# EasyEDA schematic SCH_Altimeter-Attiny_2021-11-18.json
TITLE: TinyAltimeter; REV: 1.0; Date: 2021-11-16; Sheet: 1/1; Drawn By: Sujay Sreedhar; Company: SSERD
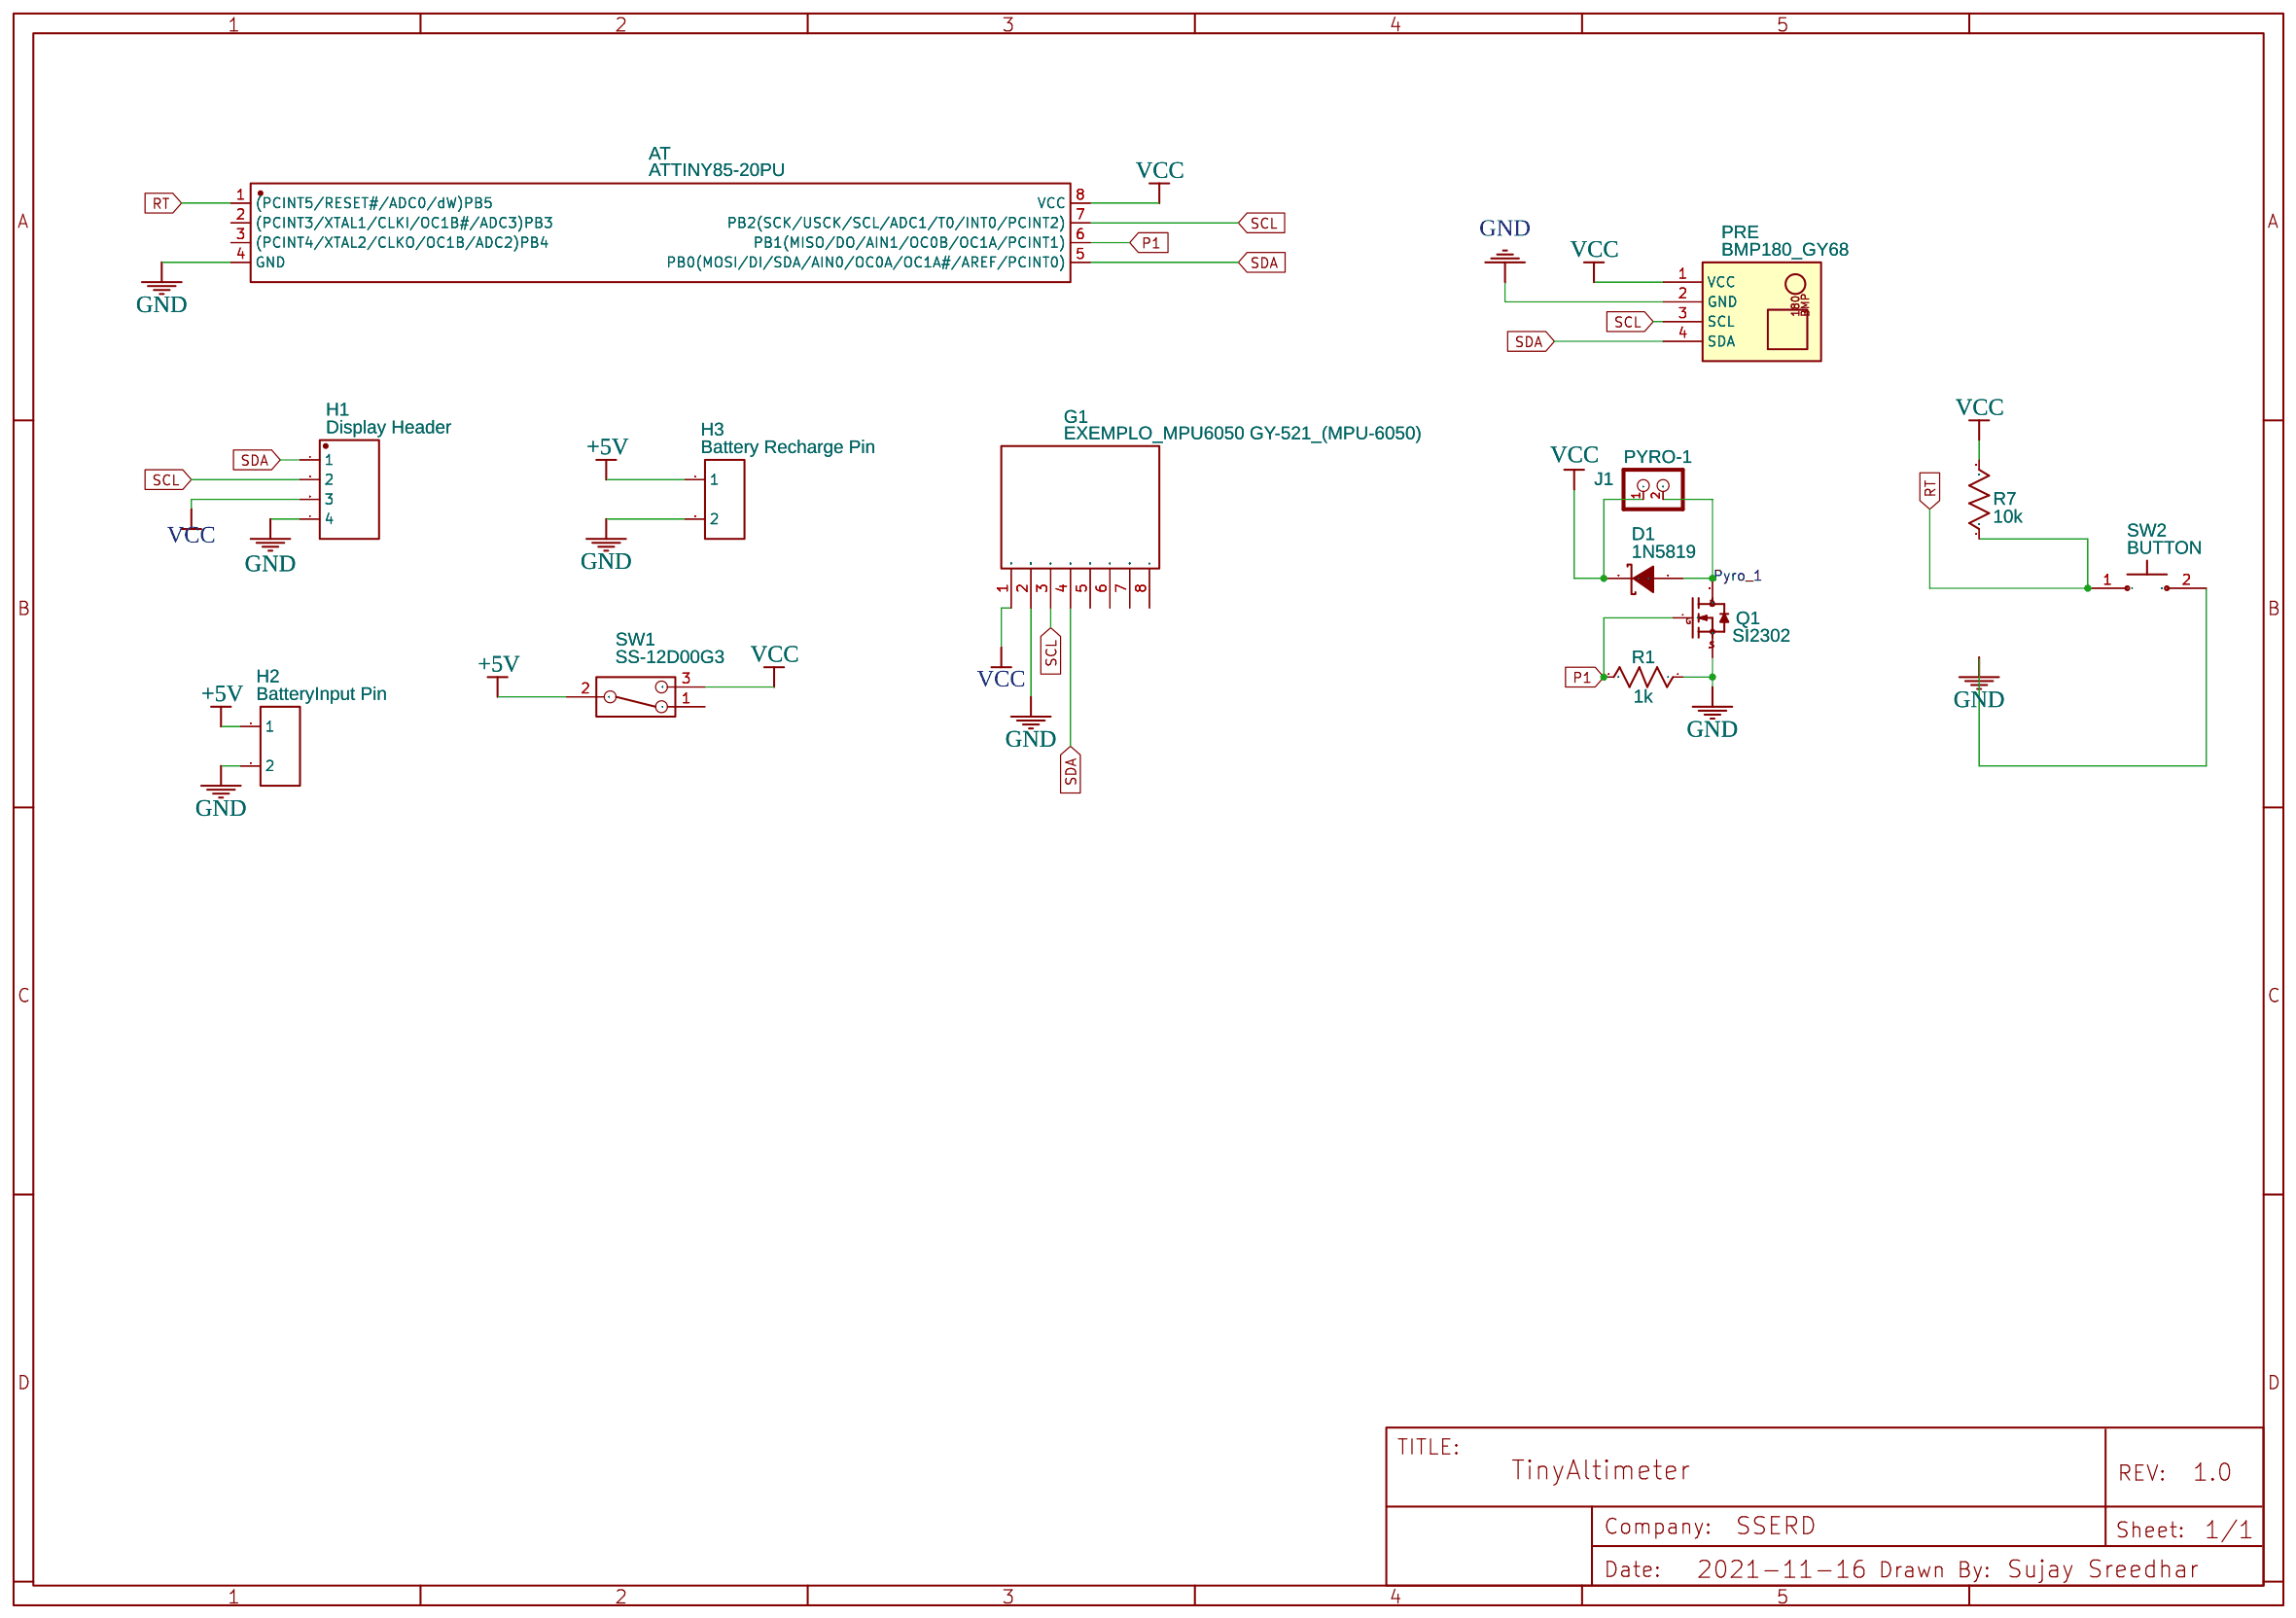
[diagram p0: schematic sheet]

## Parts
AT  ATTINY85-20PU  [PDIP-8_L9.3-W6.4-P2.54-LS7.6-BL]
D1  1N5819  [SMA_L4.4-W2.6-LS5.0-RD]
G1  EXEMPLO_MPU6050 GY-521_(MPU-6050)  [GY-521 MPU6050 MODULE]
H1  Display Header  [HDR-TH_4P-P2.54-V-M]
H2  BatteryInput Pin  [HDR-TH_2P-P2.54-V-M-1]
H3  Battery Recharge Pin  [HDR-TH_2P-P2.54-V-M-1]
J1  PYRO-1  [TERMINAL_BLOCK_2P_5]
PRE  BMP180_GY68  [BMP180 EINDELIJK GOEDE BMP180]
Q1  SI2302  [SOT-23-3_L2.9-W1.3-P1.90-LS2.4-BR]
R1  1k  [R1206]
R7  10k  [R1206]
SW1  SS-12D00G3  [SW-TH_SS-12D00G3]
SW2  BUTTON  [PB6MM]

## Library data of the parts
AT = ATTINY85-20PU: Supplier: LCSC; Supplier Part: C965497; Manufacturer: MICROCHIP(美国微芯); Contributor: LCSC
D1 = 1N5819: Supplier: LCSC; Manufacturer: STMicroelectronics; Supplier Part: C110032; JLCPCB Part Class: Extended Part
G1 = EXEMPLO_MPU6050 GY-521_(MPU-6050): Manufacturer Part: GY-521; Supplier Part: GY-521; link: Beschleunigungssensor Breakout; Contributor: RobertoCarlosAlvarenga
H1 = Header-Male-2.54_1x4: Supplier: LCSC; Manufacturer: Ckmtw; Manufacturer Part: 210S-1*4P L=11.6MMGold-plated black; Contributor: LCSC; Supplier Part: C124378; JLCPCB Part Class: Extended Part
H2 H3 = Header-Male-2.54_1x2: Supplier: LCSC; Manufacturer: TE Connectivity; Manufacturer Part: 826629-2; Supplier Part: C86471; JLCPCB Part Class: Extended Part
J1 = CON_TERMINAL_BLOCK_02: Contributor: DangerousPrototype
PRE = BMP180_GY68: Contributor: bigsky
Q1 = SI2302: Supplier: LCSC; Manufacturer: Hottech; Contributor: LCSC; Supplier Part: C181087; JLCPCB Part Class: Extended Part
R1 R7 = R_AXIAL-0.4_US: Contributor: LCEDA_Lib
SW1 = SS-12D00G3: Contributor: WALLE1 Doctor1WHO
SW2 = BUTTON: Contributor: craindowl; sourceId: 7ZJf9qkCU; sim: true

## Nets
+5V: H2.1 H3.1 SW1.2
GND: AT.4(GND) G1.2(GND) H1.4 H2.2 H3.2 PRE.2(GND) Q1.2(S) R1.1 SW2.2
VCC: AT.8(VCC) D1.2(K) G1.1(VCC) H1.3 J1.1 PRE.1(VCC) R7.2 SW1.3
P1: AT.6(PB1(MISO/DO/AIN1/OC0B/OC1A/PCINT1)) Q1.1(G) R1.2
Pyro_1: D1.1(A) J1.2 Q1.3(D)
RT: AT.1((PCINT5/RESET#/ADC0/dW)PB5) R7.1 SW2.1
SCL: AT.7(PB2(SCK/USCK/SCL/ADC1/T0/INT0/PCINT2)) G1.3(SCL) H1.2 PRE.3(SCL)
SDA: AT.5(PB0(MOSI/DI/SDA/AIN0/OC0A/OC1A#/AREF/PCINT0)) G1.4(SDA) H1.1 PRE.4(SDA)

Not connected (* = marked no-connect by the designer): AT 2((PCINT3/XTAL1/CLKI/OC1B#/ADC3)PB3) 3((PCINT4/XTAL2/CLKO/OC1B/ADC2)PB4); G1 5(XDA) 6(XCL) 7(AD0) 8(INT); SW1 1
